# Altium schematic sheet 2017-08-17_05-35-231.schdoc
size 308 x 191 mm; SheetNumber: 1; SheetTotal: 1
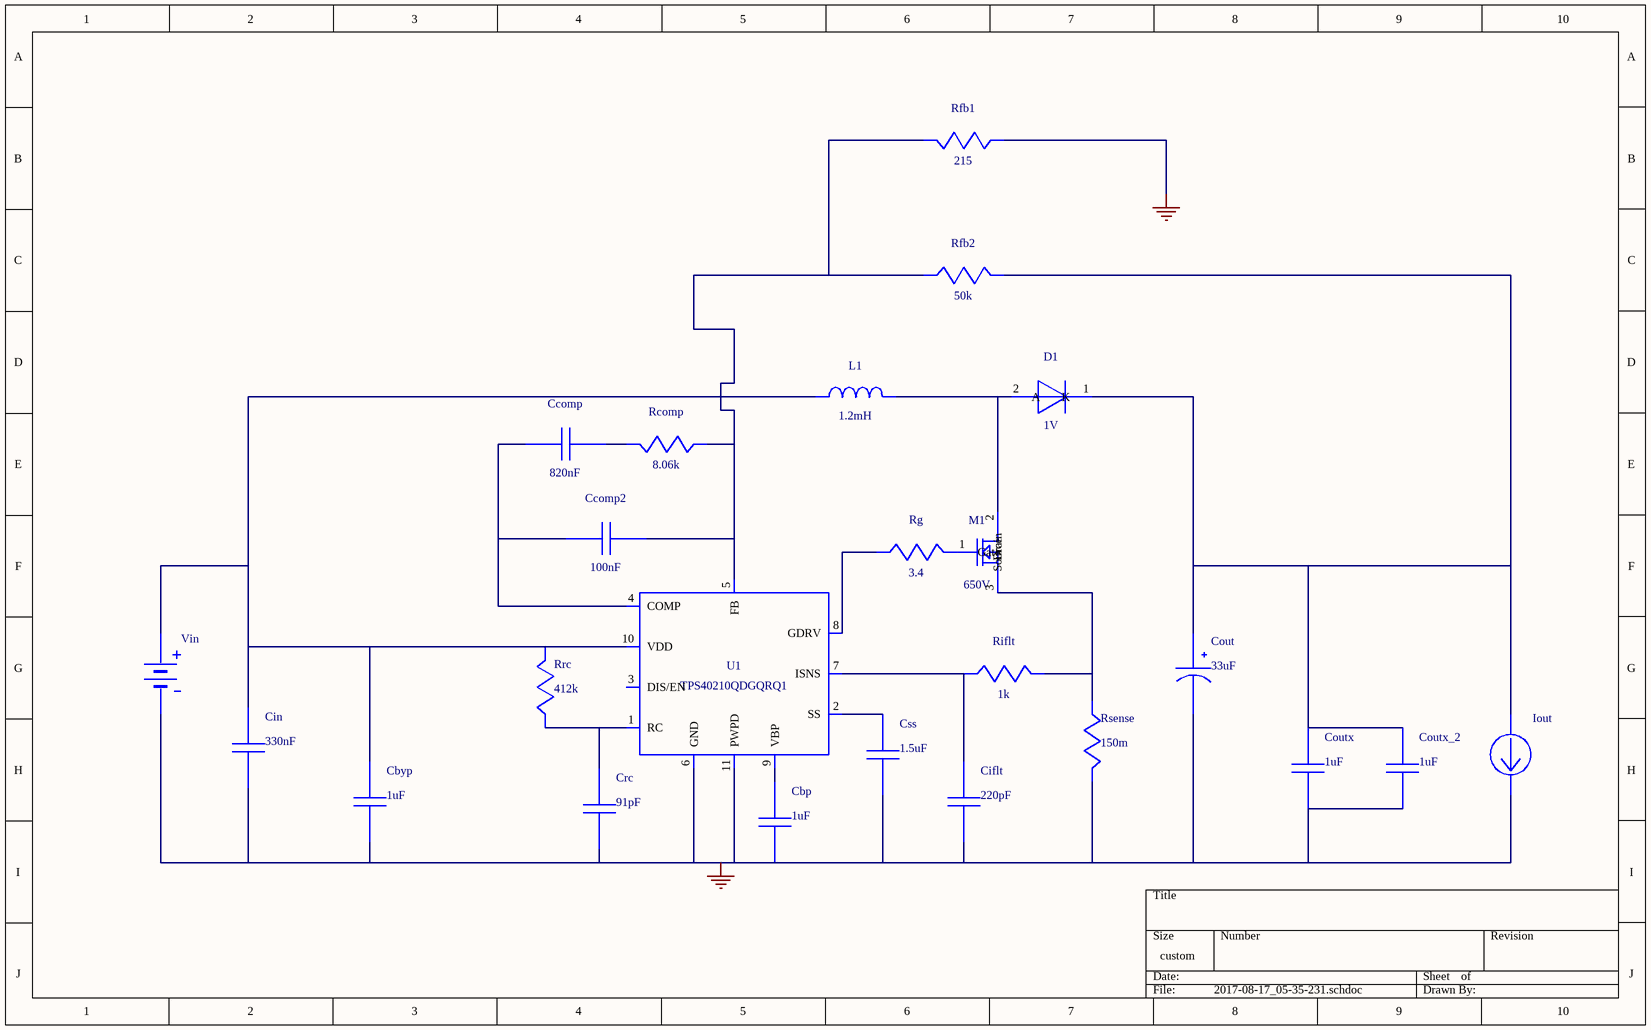
[diagram p0: 2017-08-17_05-35-231.schdoc]

## Parts
Cbp  value 1uF  (hidden comment: EMK107B7105KA-T)
Cbyp  value 1uF  (hidden comment: GRM219R71E105KA88D)
Ccomp  value 820nF  (hidden comment: GRM155R61A824KE15D)
Ccomp2  value 100nF  (hidden comment: CC0805KRX7R8BB104)
Ciflt  value 220pF  (hidden comment: CC0805JRNPO9BN221)
Cin  value 330nF  (hidden comment: C1608X5R1H334K080AB)
Cout  value 33uF  (hidden comment: EEV-EB2E330SM)
Coutx  value 1uF  (hidden comment: GRM55DR72E105KW01L)
Coutx_2  value 1uF  (hidden comment: GRM55DR72E105KW01L)
Crc  value 91pF  (hidden comment: CL21C910JBANNNC)
Css  value 1.5uF  (hidden comment: C1608X7R1A155K080AC)
D1  value 1V  (hidden comment: UF4004TA)
Iout  WB_CURRENT_LOAD  (value not drawn)
L1  value 1.2mH  (hidden comment: MSS1210-125KEB)
M1  value 650V  (hidden comment: STD16N65M5)
Rcomp  value 8.06k  (hidden comment: CRCW04028K06FKED)
Rfb1  value 215  (hidden comment: CRCW0402215RFKED)
Rfb2  value 50k  (hidden comment: CUSTOM1)
Rg  value 3.4  (hidden comment: CRCW04023R40FKED)
Riflt  value 1k  (hidden comment: CRCW04021K00FKED)
Rrc  value 412k  (hidden comment: CRCW0402412KFKED)
Rsense  value 150m  (hidden comment: ERJ-3RSFR15V)
U1  TPS40210QDGQRQ1
Vin  WB_BATTERY  (value not drawn)

## Nets
0: Cbp.2 Cbyp.2 Ciflt.2 Cin.2 Cout.2(-) Coutx.2 Coutx_2.2 Crc.2 Css.2 Iout.2(-) Rfb1.2 Rsense.1 U1.6(GND) U1.11(PWPD) Vin.2(-)
NetCbp_1: Cbp.1 U1.9(VBP)
NetCbyp_1: Cbyp.1 Cin.1 L1.1 Rrc.1 U1.10(VDD) Vin.1(+)
NetCcomp2_2: Ccomp2.2 Rcomp.2 Rfb1.1 Rfb2.1 U1.5(FB)
NetCcomp_1: Ccomp.1 Ccomp2.1 U1.4(COMP)
NetCcomp_2: Ccomp.2 Rcomp.1
NetCiflt_1: Ciflt.1 Riflt.2 U1.7(ISNS)
NetCout_1: Cout.1(+) Coutx.1 Coutx_2.1 D1.1(K) Iout.1(+) Rfb2.2
NetCrc_1: Crc.1 Rrc.2 U1.1(RC)
NetCss_1: Css.1 U1.2(SS)
NetD1_2: D1.2(A) L1.2 M1.2(Drain)
NetM1_1: M1.1(Gate) Rg.1
NetM1_3: M1.3(Source) Riflt.1 Rsense.2
NetRg_2: Rg.2 U1.8(GDRV)

Not connected (* = marked no-connect by the designer): U1 3(DIS/EN)

## Library data of the parts
Cbp = EMK107B7105KA-T: Manufacturer Name: Taiyo Yuden; PackageReference: EMK107B7105KA-T; Manufacturer Part Number: EMK107B7105KA-T
Cbyp = GRM219R71E105KA88D: GRM219R71E105KA8; Manufacturer Name: MuRata; PackageReference: GRM219R71E105KA88D; Manufacturer Part Number: GRM219R71E105KA88D
Ccomp = GRM155R61A824KE15D: GRM155R61A824KE1; Manufacturer Name: MuRata; PackageReference: GRM155R61A824KE15D; Manufacturer Part Number: GRM155R61A824KE15D
Ccomp2 = CC0805KRX7R8BB104: CC0805KRX7R8BB10; Manufacturer Name: Yageo America; PackageReference: CC0805KRX7R8BB104; Manufacturer Part Number: CC0805KRX7R8BB104
Ciflt = CC0805JRNPO9BN221: CC0805JRNPO9BN22; Manufacturer Name: Yageo America; PackageReference: CC0805JRNPO9BN221; Manufacturer Part Number: CC0805JRNPO9BN221
Cin = C1608X5R1H334K080AB: C1608X5R1H334K08; Manufacturer Name: TDK; PackageReference: C1608X5R1H334K080AB; Manufacturer Part Number: C1608X5R1H334K080AB
Cout = EEV-EB2E330SM: Manufacturer Name: Panasonic; PackageReference: EEV-EB2E330SM; Manufacturer Part Number: EEV-EB2E330SM
Coutx Coutx_2 = GRM55DR72E105KW01L: GRM55DR72E105KW0; Manufacturer Name: MuRata; PackageReference: GRM55DR72E105KW01L; Manufacturer Part Number: GRM55DR72E105KW01L
Crc = CL21C910JBANNNC: Manufacturer Name: Samsung Electro-Mechanics; PackageReference: CL21C910JBANNNC; Manufacturer Part Number: CL21C910JBANNNC
Css = C1608X7R1A155K080AC: C1608X7R1A155K08; Manufacturer Name: TDK; PackageReference: C1608X7R1A155K080AC; Manufacturer Part Number: C1608X7R1A155K080AC
D1 = UF4004TA: Manufacturer Name: SMC Diode Solutions; PackageReference: UF4004TA; Manufacturer Part Number: UF4004TA
L1 = MSS1210-125KEB: Unknown; Manufacturer Name: Coilcraft; PackageReference: MSS1210-125KEB; Manufacturer Part Number: MSS1210-125KEB
M1 = STD16N65M5: Manufacturer Name: STMicroelectronics; PackageReference: STD16N65M5; Manufacturer Part Number: STD16N65M5
Rcomp = CRCW04028K06FKED: Manufacturer Name: Vishay-Dale; PackageReference: CRCW04028K06FKED; Manufacturer Part Number: CRCW04028K06FKED
Rfb1 = CRCW0402215RFKED: Manufacturer Name: Vishay-Dale; PackageReference: CRCW0402215RFKED; Manufacturer Part Number: CRCW0402215RFKED
Rfb2 = CUSTOM1: Manufacturer Name: CUSTOM; PackageReference: CUSTOM; Manufacturer Part Number: CUSTOM1
Rg = CRCW04023R40FKED: Manufacturer Name: Vishay-Dale; PackageReference: CRCW04023R40FKED; Manufacturer Part Number: CRCW04023R40FKED
Riflt = CRCW04021K00FKED: Manufacturer Name: Vishay-Dale; PackageReference: CRCW04021K00FKED; Manufacturer Part Number: CRCW04021K00FKED
Rrc = CRCW0402412KFKED: Manufacturer Name: Vishay-Dale; PackageReference: CRCW0402412KFKED; Manufacturer Part Number: CRCW0402412KFKED
Rsense = ERJ-3RSFR15V: Manufacturer Name: Panasonic; PackageReference: ERJ-3RSFR15V; Manufacturer Part Number: ERJ-3RSFR15V
U1 = TPS40210QDGQRQ1: Manufacturer Name: Texas Instruments; PackageReference: TPS40210QDGQRQ1; Manufacturer Part Number: TPS40210QDGQRQ1; Value: N/A
Iout = WB_CURRENT_LOAD: PackageReference: WB_CURRENT_LOAD; Manufacturer Part Number: WB_CURRENT_LOAD; Manufacturer Name: WB_CURRENT_LOAD; Value: N/A
Vin = WB_BATTERY: PackageReference: WB_BATTERY; Manufacturer Part Number: WB_BATTERY; Manufacturer Name: WB_BATTERY; Value: N/A